# Altium schematic sheet MB1019.SchDoc
size A3; Revision: C.2
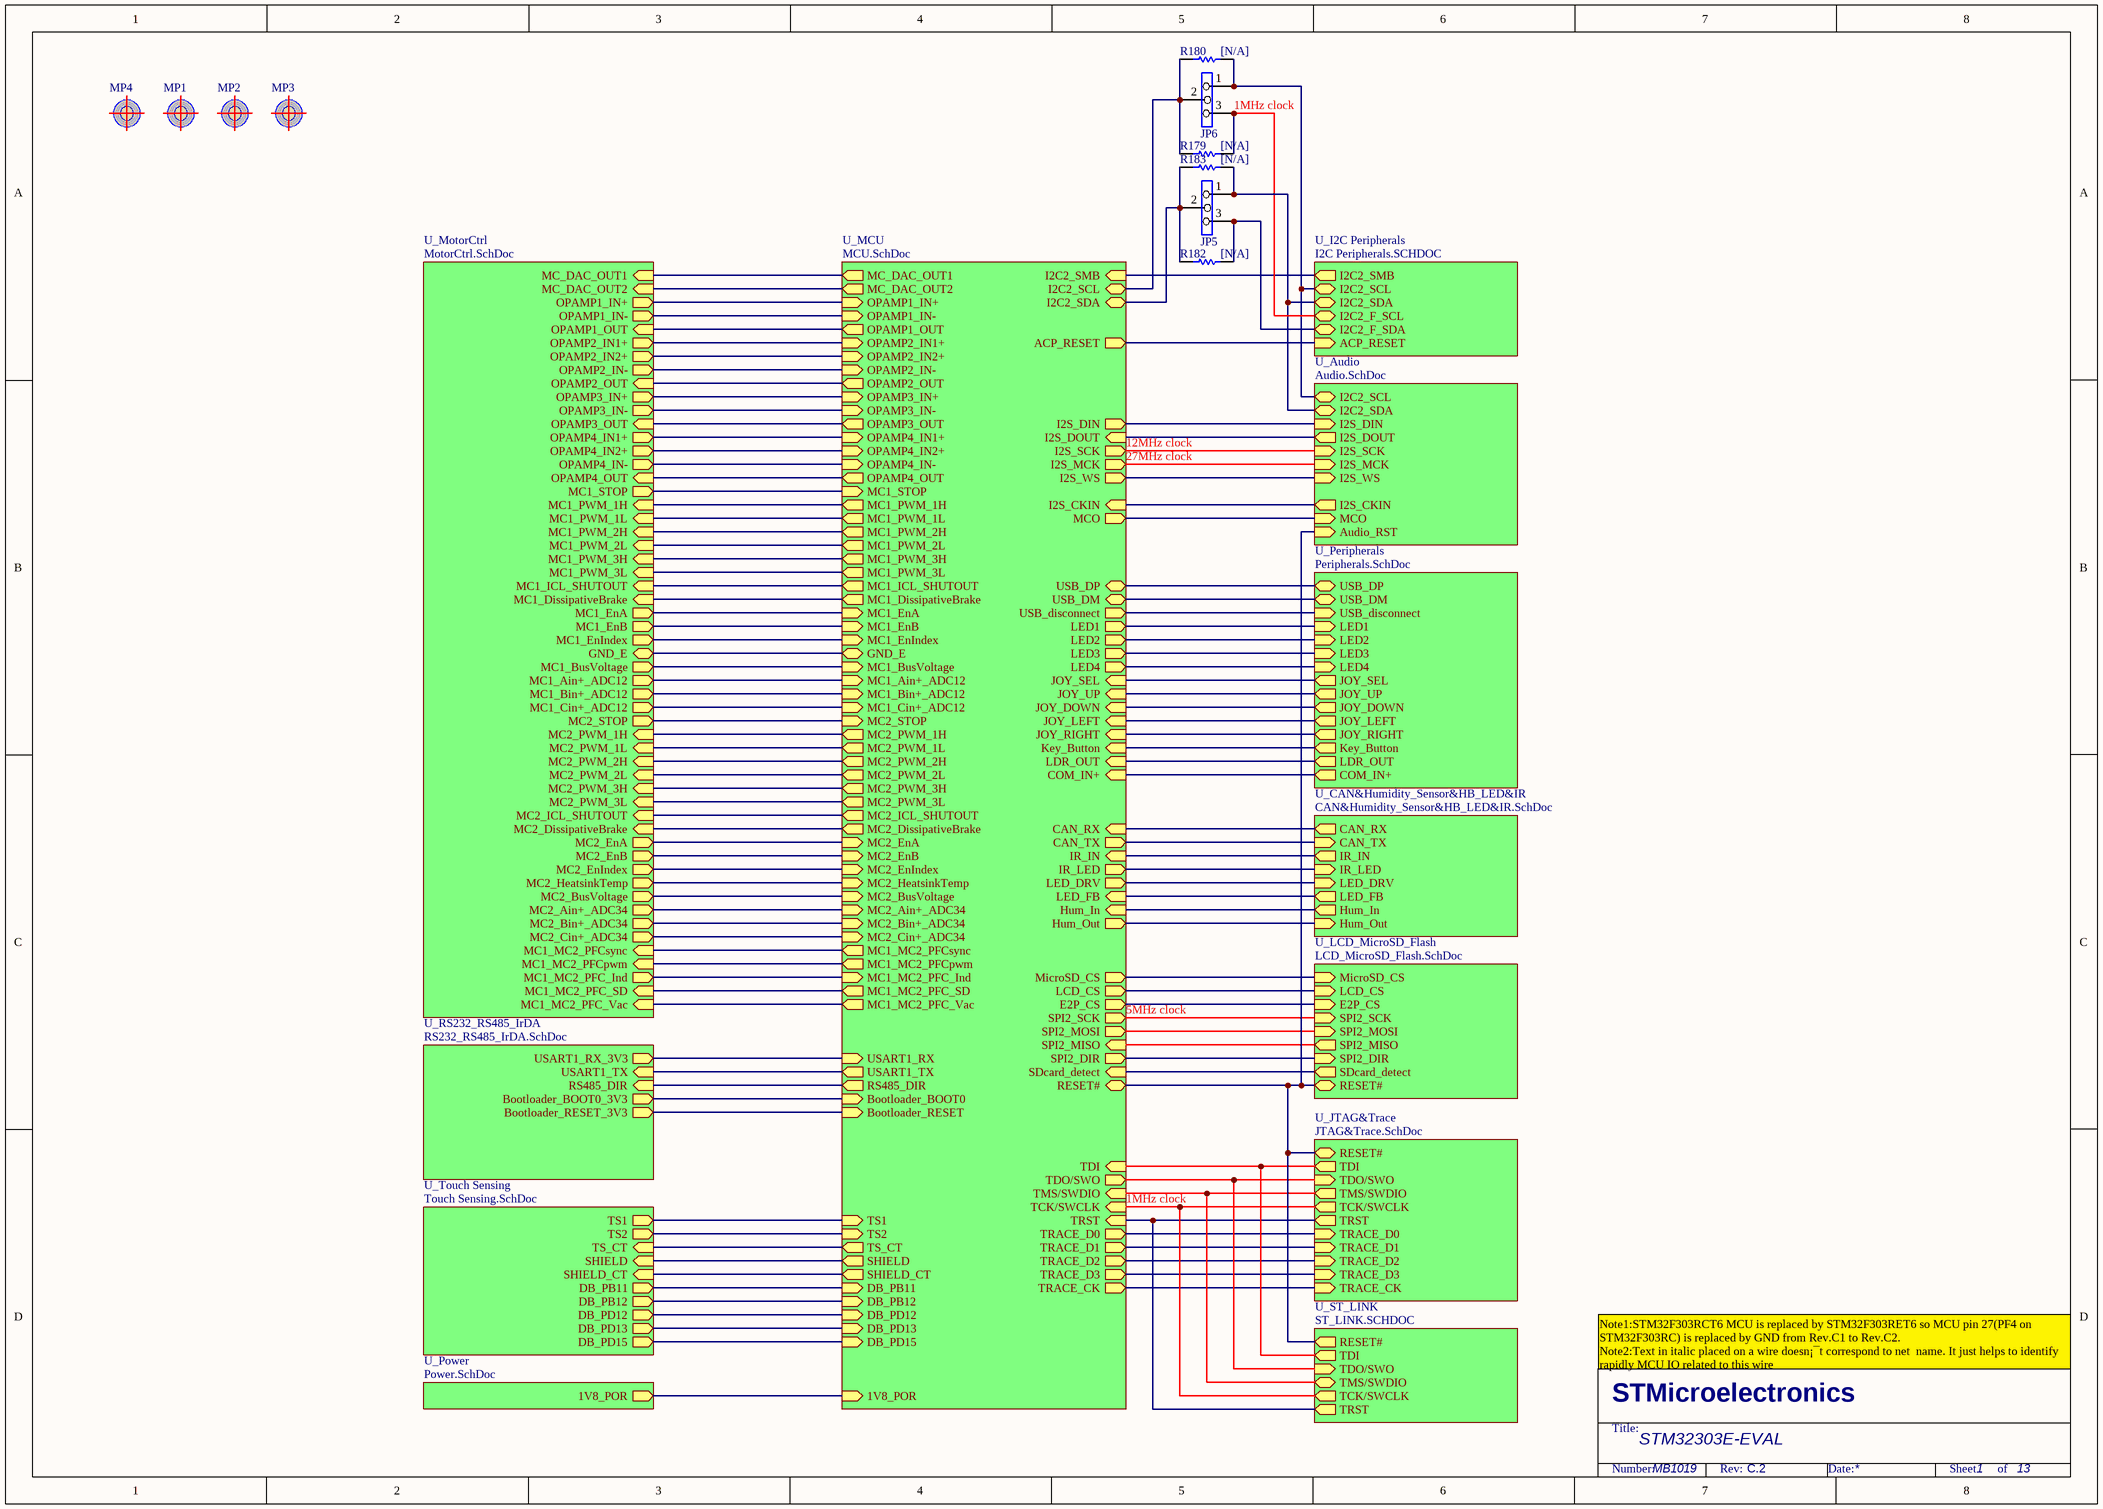
[diagram p0: MB1019.SchDoc]

## Parts
JP5  (no value)  [SIP3]
JP6  (no value)  [SIP3]
MP1  (no value)  [markpoint_1.0]
MP2  (no value)  [markpoint_1.0]
MP3  (no value)  [markpoint_1.0]
MP4  (no value)  [markpoint_1.0]
R179  [N/A]  [0603R]
R180  [N/A]  [0603R]
R182  [N/A]  [0603R]
R183  [N/A]  [0603R]

## Sub-sheets
U_Audio = Audio.SchDoc: I2S_WS (in), I2S_DIN (in), I2S_SCK (in), Audio_RST (in), I2S_MCK (in), MCO (in), I2S_CKIN (out), I2C2_SCL (bidir), I2C2_SDA (bidir), I2S_DOUT (out)
U_CAN&Humidity_Sensor&HB_LED&IR = CAN&Humidity_Sensor&HB_LED&IR.SchDoc: CAN_TX (in), CAN_RX (out), IR_LED (in), IR_IN (out), LED_DRV (in), LED_FB (out), Hum_Out (in), Hum_In (out)
U_I2C Peripherals = I2C Peripherals.SCHDOC: I2C2_SCL (bidir), I2C2_SDA (bidir), I2C2_SMB (out), I2C2_F_SDA (bidir), I2C2_F_SCL (bidir), ACP_RESET (in)
U_JTAG&Trace = JTAG&Trace.SchDoc: TDI (out), RESET# (bidir), TRACE_D3 (in), TRACE_D2 (in), TRACE_D1 (in), TRACE_D0 (in), TRACE_CK (in), TRST (out), TMS/SWDIO (out), TCK/SWCLK (out), TDO/SWO (in)
U_LCD_MicroSD_Flash = LCD_MicroSD_Flash.SchDoc: MicroSD_CS (in), SPI2_SCK (in), SPI2_MOSI (in), LCD_CS (in), SDcard_detect (out), RESET# (bidir), E2P_CS (in), SPI2_MISO (out), SPI2_DIR (in)
U_MCU = MCU.SchDoc: USB_DM (bidir), I2C2_SCL (bidir), I2C2_SDA (bidir), TMS/SWDIO (in), TCK/SWCLK (in), TDI (in), COM_IN+ (in), TDO/SWO (out), TRST (in), IR_IN (in), IR_LED (out), SPI2_MISO (in), SPI2_MOSI (out), RESET# (bidir), LDR_OUT (in), SPI2_SCK (out), USART1_RX (in), USART1_TX (out), LED4 (out), LED3 (out), LED1 (out), LED2 (out), Bootloader_BOOT0 (in), Bootloader_RESET (in), I2C2_SMB (in), USB_DP (bidir), CAN_RX (in), CAN_TX (out), MicroSD_CS (out), TRACE_D0 (out), TRACE_D1 (out), Key_Button (in), JOY_SEL (in), JOY_DOWN (in), JOY_LEFT (in), JOY_UP (in), JOY_RIGHT (in), TRACE_CK (out), E2P_CS (out), LCD_CS (out), TRACE_D2 (out), TRACE_D3 (out), SDcard_detect (in), DB_PD13 (in), DB_PD15 (in), 1V8_POR (in), USB_disconnect (out), MC2_HeatsinkTemp (in), OPAMP1_IN+ (in), OPAMP2_IN1+ (in), OPAMP3_IN+ (in), OPAMP3_OUT (out), OPAMP3_IN- (in), MC2_EnA (in), MC2_STOP (in), MC2_EnIndex (in), OPAMP4_IN- (in), OPAMP4_OUT (out), OPAMP4_IN1+ (in), MC1_Cin+_ADC12 (in), MC1_Ain+_ADC12 (in), MC1_Bin+_ADC12 (in), MC2_PWM_1H (out), MC2_PWM_2H (out), MC2_PWM_3H (out), MC2_PWM_1L (out), MC2_PWM_2L (out), MC2_PWM_3L (out), MC1_MC2_PFC_SD (out), MC1_EnA (in), MC1_EnB (in), MC1_EnIndex (in), MC1_MC2_PFC_Ind (in), MC2_EnB (in), MC1_MC2_PFCsync (out), MC1_MC2_PFCpwm (out), MC1_ICL_SHUTOUT (out), MC1_DissipativeBrake (out), MC1_PWM_1H (out), MC1_PWM_2H (out), MC1_PWM_3H (out), MC1_PWM_1L (out), MC1_PWM_2L (out), MC1_PWM_3L (out), LED_DRV (out), MC1_STOP (in), LED_FB (in), GND_E (bidir), MC2_ICL_SHUTOUT (out), MC2_DissipativeBrake (out), MC1_MC2_PFC_Vac (out), MC2_BusVoltage (in), MC_DAC_OUT1 (out), MC_DAC_OUT2 (out), OPAMP1_OUT (out), OPAMP1_IN- (in), OPAMP2_OUT (out), OPAMP4_IN2+ (in), OPAMP2_IN2+ (in), MC1_BusVoltage (in), RS485_DIR (out), Hum_Out (out), TS2 (in), Hum_In (in), I2S_WS (out), SHIELD (out), OPAMP2_IN- (in), MC2_Cin+_ADC34 (in), MC2_Ain+_ADC34 (in), MC2_Bin+_ADC34 (in), TS_CT (out), TS1 (in), DB_PB12 (in), SHIELD_CT (out), DB_PD12 (in), DB_PB11 (in), ACP_RESET (out), I2S_CKIN (in), MCO (out), I2S_DIN (out), I2S_SCK (out), I2S_MCK (out), I2S_DOUT (in), SPI2_DIR (out)
U_MotorCtrl = MotorCtrl.SchDoc: MC1_STOP (out), MC1_MC2_PFCsync (in), MC1_ICL_SHUTOUT (in), MC1_DissipativeBrake (in), MC1_MC2_PFCpwm (in), MC1_EnA (out), MC1_EnB (out), GND_E (bidir), MC1_BusVoltage (out), MC1_EnIndex (out), MC1_PWM_1H (in), MC1_PWM_2H (in), MC1_PWM_3H (in), MC1_PWM_1L (in), MC1_PWM_2L (in), MC1_PWM_3L (in), MC1_MC2_PFC_Ind (out), MC1_MC2_PFC_Vac (in), MC1_MC2_PFC_SD (in), MC2_STOP (out), MC2_ICL_SHUTOUT (in), MC2_DissipativeBrake (in), MC2_EnA (out), MC2_EnB (out), MC2_HeatsinkTemp (out), MC2_BusVoltage (out), MC2_EnIndex (out), MC2_PWM_1H (in), MC2_PWM_2H (in), MC2_PWM_3H (in), MC2_PWM_1L (in), MC2_PWM_2L (in), MC2_PWM_3L (in), OPAMP1_IN+ (out), OPAMP1_IN- (out), OPAMP1_OUT (in), MC1_Ain+_ADC12 (out), MC_DAC_OUT2 (in), MC_DAC_OUT1 (in), OPAMP2_IN1+ (out), OPAMP2_IN- (out), OPAMP2_OUT (in), OPAMP2_IN2+ (out), OPAMP4_IN1+ (out), OPAMP4_IN- (out), OPAMP4_OUT (in), OPAMP4_IN2+ (out), OPAMP3_IN+ (out), OPAMP3_IN- (out), OPAMP3_OUT (in), MC1_Bin+_ADC12 (out), MC1_Cin+_ADC12 (out), MC2_Cin+_ADC34 (out), MC2_Bin+_ADC34 (out), MC2_Ain+_ADC34 (out)
U_Peripherals = Peripherals.SchDoc: JOY_SEL (out), JOY_DOWN (out), JOY_LEFT (out), JOY_RIGHT (out), JOY_UP (out), USB_DM (bidir), USB_DP (bidir), Key_Button (out), USB_disconnect (in), LDR_OUT (out), COM_IN+ (out), LED4 (in), LED3 (in), LED1 (in), LED2 (in)
U_Power = Power.SchDoc: 1V8_POR (out)
U_RS232_RS485_IrDA = RS232_RS485_IrDA.SchDoc: USART1_RX_3V3 (out), RS485_DIR (in), Bootloader_BOOT0_3V3 (out), Bootloader_RESET_3V3 (out), USART1_TX (in)
U_ST_LINK = ST_LINK.SCHDOC: TDI (out), TRST (out), TMS/SWDIO (bidir), TCK/SWCLK (out), TDO/SWO (in), RESET# (out)
U_Touch Sensing = Touch Sensing.SchDoc: TS1 (out), TS2 (out), SHIELD (in), SHIELD_CT (in), TS_CT (in), DB_PD13 (out), DB_PD15 (out), DB_PD12 (out), DB_PB11 (out), DB_PB12 (out)

## Nets
NetJP5_1: JP5.1 R183.1 ; sheet U_Audio/I2C2_SDA, sheet U_I2C Peripherals/I2C2_SDA
NetJP5_2: JP5.2 R182.2 R183.2 ; sheet U_MCU/I2C2_SDA
NetJP5_3: JP5.3 R182.1 ; sheet U_I2C Peripherals/I2C2_F_SDA
NetJP6_1: JP6.1 R180.1 ; sheet U_Audio/I2C2_SCL, sheet U_I2C Peripherals/I2C2_SCL
NetJP6_2: JP6.2 R179.2 R180.2 ; sheet U_MCU/I2C2_SCL
NetJP6_3: JP6.3 R179.1 ; sheet U_I2C Peripherals/I2C2_F_SCL
(unnamed): sheet U_MCU/USB_DM, sheet U_Peripherals/USB_DM
(unnamed): sheet U_MCU/TMS/SWDIO, sheet U_JTAG&Trace/TMS/SWDIO, sheet U_ST_LINK/TMS/SWDIO
(unnamed): sheet U_MCU/TCK/SWCLK, sheet U_JTAG&Trace/TCK/SWCLK, sheet U_ST_LINK/TCK/SWCLK
(unnamed): sheet U_MCU/TDI, sheet U_JTAG&Trace/TDI, sheet U_ST_LINK/TDI
(unnamed): sheet U_MCU/COM_IN+, sheet U_Peripherals/COM_IN+
(unnamed): sheet U_MCU/TDO/SWO, sheet U_JTAG&Trace/TDO/SWO, sheet U_ST_LINK/TDO/SWO
(unnamed): sheet U_MCU/TRST, sheet U_JTAG&Trace/TRST, sheet U_ST_LINK/TRST
(unnamed): sheet U_MCU/IR_IN, sheet U_CAN&Humidity_Sensor&HB_LED&IR/IR_IN
(unnamed): sheet U_MCU/IR_LED, sheet U_CAN&Humidity_Sensor&HB_LED&IR/IR_LED
(unnamed): sheet U_MCU/SPI2_MISO, sheet U_LCD_MicroSD_Flash/SPI2_MISO
(unnamed): sheet U_MCU/SPI2_MOSI, sheet U_LCD_MicroSD_Flash/SPI2_MOSI
(unnamed): sheet U_MCU/RESET#, sheet U_JTAG&Trace/RESET#, sheet U_ST_LINK/RESET#, sheet U_Audio/Audio_RST, sheet U_LCD_MicroSD_Flash/RESET#
(unnamed): sheet U_MCU/LDR_OUT, sheet U_Peripherals/LDR_OUT
(unnamed): sheet U_MCU/SPI2_SCK, sheet U_LCD_MicroSD_Flash/SPI2_SCK
(unnamed): sheet U_MCU/USART1_RX, sheet U_RS232_RS485_IrDA/USART1_RX_3V3
(unnamed): sheet U_MCU/USART1_TX, sheet U_RS232_RS485_IrDA/USART1_TX
(unnamed): sheet U_MCU/LED4, sheet U_Peripherals/LED4
(unnamed): sheet U_MCU/LED3, sheet U_Peripherals/LED3
(unnamed): sheet U_MCU/LED1, sheet U_Peripherals/LED1
(unnamed): sheet U_MCU/LED2, sheet U_Peripherals/LED2
(unnamed): sheet U_MCU/Bootloader_BOOT0, sheet U_RS232_RS485_IrDA/Bootloader_BOOT0_3V3
(unnamed): sheet U_MCU/Bootloader_RESET, sheet U_RS232_RS485_IrDA/Bootloader_RESET_3V3
(unnamed): sheet U_MCU/I2C2_SMB, sheet U_I2C Peripherals/I2C2_SMB
(unnamed): sheet U_MCU/USB_DP, sheet U_Peripherals/USB_DP
(unnamed): sheet U_MCU/CAN_RX, sheet U_CAN&Humidity_Sensor&HB_LED&IR/CAN_RX
(unnamed): sheet U_MCU/CAN_TX, sheet U_CAN&Humidity_Sensor&HB_LED&IR/CAN_TX
(unnamed): sheet U_MCU/MicroSD_CS, sheet U_LCD_MicroSD_Flash/MicroSD_CS
(unnamed): sheet U_MCU/TRACE_D0, sheet U_JTAG&Trace/TRACE_D0
(unnamed): sheet U_MCU/TRACE_D1, sheet U_JTAG&Trace/TRACE_D1
(unnamed): sheet U_MCU/Key_Button, sheet U_Peripherals/Key_Button
(unnamed): sheet U_MCU/JOY_SEL, sheet U_Peripherals/JOY_SEL
(unnamed): sheet U_MCU/JOY_DOWN, sheet U_Peripherals/JOY_DOWN
(unnamed): sheet U_MCU/JOY_LEFT, sheet U_Peripherals/JOY_LEFT
(unnamed): sheet U_MCU/JOY_UP, sheet U_Peripherals/JOY_UP
(unnamed): sheet U_MCU/JOY_RIGHT, sheet U_Peripherals/JOY_RIGHT
(unnamed): sheet U_MCU/TRACE_CK, sheet U_JTAG&Trace/TRACE_CK
(unnamed): sheet U_MCU/E2P_CS, sheet U_LCD_MicroSD_Flash/E2P_CS
(unnamed): sheet U_MCU/LCD_CS, sheet U_LCD_MicroSD_Flash/LCD_CS
(unnamed): sheet U_MCU/TRACE_D2, sheet U_JTAG&Trace/TRACE_D2
(unnamed): sheet U_MCU/TRACE_D3, sheet U_JTAG&Trace/TRACE_D3
(unnamed): sheet U_MCU/SDcard_detect, sheet U_LCD_MicroSD_Flash/SDcard_detect
(unnamed): sheet U_MCU/DB_PD13, sheet U_Touch Sensing/DB_PD13
(unnamed): sheet U_MCU/DB_PD15, sheet U_Touch Sensing/DB_PD15
(unnamed): sheet U_MCU/1V8_POR, sheet U_Power/1V8_POR
(unnamed): sheet U_MCU/USB_disconnect, sheet U_Peripherals/USB_disconnect
(unnamed): sheet U_MCU/MC2_HeatsinkTemp, sheet U_MotorCtrl/MC2_HeatsinkTemp
(unnamed): sheet U_MCU/OPAMP1_IN+, sheet U_MotorCtrl/OPAMP1_IN+
(unnamed): sheet U_MCU/OPAMP2_IN1+, sheet U_MotorCtrl/OPAMP2_IN1+
(unnamed): sheet U_MCU/OPAMP3_IN+, sheet U_MotorCtrl/OPAMP3_IN+
(unnamed): sheet U_MCU/OPAMP3_OUT, sheet U_MotorCtrl/OPAMP3_OUT
(unnamed): sheet U_MCU/OPAMP3_IN-, sheet U_MotorCtrl/OPAMP3_IN-
(unnamed): sheet U_MCU/MC2_EnA, sheet U_MotorCtrl/MC2_EnA
(unnamed): sheet U_MCU/MC2_STOP, sheet U_MotorCtrl/MC2_STOP
(unnamed): sheet U_MCU/MC2_EnIndex, sheet U_MotorCtrl/MC2_EnIndex
(unnamed): sheet U_MCU/OPAMP4_IN-, sheet U_MotorCtrl/OPAMP4_IN-
(unnamed): sheet U_MCU/OPAMP4_OUT, sheet U_MotorCtrl/OPAMP4_OUT
(unnamed): sheet U_MCU/OPAMP4_IN1+, sheet U_MotorCtrl/OPAMP4_IN1+
(unnamed): sheet U_MCU/MC1_Cin+_ADC12, sheet U_MotorCtrl/MC1_Cin+_ADC12
(unnamed): sheet U_MCU/MC1_Ain+_ADC12, sheet U_MotorCtrl/MC1_Ain+_ADC12
(unnamed): sheet U_MCU/MC1_Bin+_ADC12, sheet U_MotorCtrl/MC1_Bin+_ADC12
(unnamed): sheet U_MCU/MC2_PWM_1H, sheet U_MotorCtrl/MC2_PWM_1H
(unnamed): sheet U_MCU/MC2_PWM_2H, sheet U_MotorCtrl/MC2_PWM_2H
(unnamed): sheet U_MCU/MC2_PWM_3H, sheet U_MotorCtrl/MC2_PWM_3H
(unnamed): sheet U_MCU/MC2_PWM_1L, sheet U_MotorCtrl/MC2_PWM_1L
(unnamed): sheet U_MCU/MC2_PWM_2L, sheet U_MotorCtrl/MC2_PWM_2L
(unnamed): sheet U_MCU/MC2_PWM_3L, sheet U_MotorCtrl/MC2_PWM_3L
(unnamed): sheet U_MCU/MC1_MC2_PFC_SD, sheet U_MotorCtrl/MC1_MC2_PFC_SD
(unnamed): sheet U_MCU/MC1_EnA, sheet U_MotorCtrl/MC1_EnA
(unnamed): sheet U_MCU/MC1_EnB, sheet U_MotorCtrl/MC1_EnB
(unnamed): sheet U_MCU/MC1_EnIndex, sheet U_MotorCtrl/MC1_EnIndex
(unnamed): sheet U_MCU/MC1_MC2_PFC_Ind, sheet U_MotorCtrl/MC1_MC2_PFC_Ind
(unnamed): sheet U_MCU/MC2_EnB, sheet U_MotorCtrl/MC2_EnB
(unnamed): sheet U_MCU/MC1_MC2_PFCsync, sheet U_MotorCtrl/MC1_MC2_PFCsync
(unnamed): sheet U_MCU/MC1_MC2_PFCpwm, sheet U_MotorCtrl/MC1_MC2_PFCpwm
(unnamed): sheet U_MCU/MC1_ICL_SHUTOUT, sheet U_MotorCtrl/MC1_ICL_SHUTOUT
(unnamed): sheet U_MCU/MC1_DissipativeBrake, sheet U_MotorCtrl/MC1_DissipativeBrake
(unnamed): sheet U_MCU/MC1_PWM_1H, sheet U_MotorCtrl/MC1_PWM_1H
(unnamed): sheet U_MCU/MC1_PWM_2H, sheet U_MotorCtrl/MC1_PWM_2H
(unnamed): sheet U_MCU/MC1_PWM_3H, sheet U_MotorCtrl/MC1_PWM_3H
(unnamed): sheet U_MCU/MC1_PWM_1L, sheet U_MotorCtrl/MC1_PWM_1L
(unnamed): sheet U_MCU/MC1_PWM_2L, sheet U_MotorCtrl/MC1_PWM_2L
(unnamed): sheet U_MCU/MC1_PWM_3L, sheet U_MotorCtrl/MC1_PWM_3L
(unnamed): sheet U_MCU/LED_DRV, sheet U_CAN&Humidity_Sensor&HB_LED&IR/LED_DRV
(unnamed): sheet U_MCU/MC1_STOP, sheet U_MotorCtrl/MC1_STOP
(unnamed): sheet U_MCU/LED_FB, sheet U_CAN&Humidity_Sensor&HB_LED&IR/LED_FB
(unnamed): sheet U_MCU/GND_E, sheet U_MotorCtrl/GND_E
(unnamed): sheet U_MCU/MC2_ICL_SHUTOUT, sheet U_MotorCtrl/MC2_ICL_SHUTOUT
(unnamed): sheet U_MCU/MC2_DissipativeBrake, sheet U_MotorCtrl/MC2_DissipativeBrake
(unnamed): sheet U_MCU/MC1_MC2_PFC_Vac, sheet U_MotorCtrl/MC1_MC2_PFC_Vac
(unnamed): sheet U_MCU/MC2_BusVoltage, sheet U_MotorCtrl/MC2_BusVoltage
(unnamed): sheet U_MCU/MC_DAC_OUT1, sheet U_MotorCtrl/MC_DAC_OUT1
(unnamed): sheet U_MCU/MC_DAC_OUT2, sheet U_MotorCtrl/MC_DAC_OUT2
(unnamed): sheet U_MCU/OPAMP1_OUT, sheet U_MotorCtrl/OPAMP1_OUT
(unnamed): sheet U_MCU/OPAMP1_IN-, sheet U_MotorCtrl/OPAMP1_IN-
(unnamed): sheet U_MCU/OPAMP2_OUT, sheet U_MotorCtrl/OPAMP2_OUT
(unnamed): sheet U_MCU/OPAMP4_IN2+, sheet U_MotorCtrl/OPAMP4_IN2+
(unnamed): sheet U_MCU/OPAMP2_IN2+, sheet U_MotorCtrl/OPAMP2_IN2+
(unnamed): sheet U_MCU/MC1_BusVoltage, sheet U_MotorCtrl/MC1_BusVoltage
(unnamed): sheet U_MCU/RS485_DIR, sheet U_RS232_RS485_IrDA/RS485_DIR
(unnamed): sheet U_MCU/Hum_Out, sheet U_CAN&Humidity_Sensor&HB_LED&IR/Hum_Out
(unnamed): sheet U_MCU/TS2, sheet U_Touch Sensing/TS2
(unnamed): sheet U_MCU/Hum_In, sheet U_CAN&Humidity_Sensor&HB_LED&IR/Hum_In
(unnamed): sheet U_MCU/I2S_WS, sheet U_Audio/I2S_WS
(unnamed): sheet U_MCU/SHIELD, sheet U_Touch Sensing/SHIELD
(unnamed): sheet U_MCU/OPAMP2_IN-, sheet U_MotorCtrl/OPAMP2_IN-
(unnamed): sheet U_MCU/MC2_Cin+_ADC34, sheet U_MotorCtrl/MC2_Cin+_ADC34
(unnamed): sheet U_MCU/MC2_Ain+_ADC34, sheet U_MotorCtrl/MC2_Ain+_ADC34
(unnamed): sheet U_MCU/MC2_Bin+_ADC34, sheet U_MotorCtrl/MC2_Bin+_ADC34
(unnamed): sheet U_MCU/TS_CT, sheet U_Touch Sensing/TS_CT
(unnamed): sheet U_MCU/TS1, sheet U_Touch Sensing/TS1
(unnamed): sheet U_MCU/DB_PB12, sheet U_Touch Sensing/DB_PB12
(unnamed): sheet U_MCU/SHIELD_CT, sheet U_Touch Sensing/SHIELD_CT
(unnamed): sheet U_MCU/DB_PD12, sheet U_Touch Sensing/DB_PD12
(unnamed): sheet U_MCU/DB_PB11, sheet U_Touch Sensing/DB_PB11
(unnamed): sheet U_MCU/ACP_RESET, sheet U_I2C Peripherals/ACP_RESET
(unnamed): sheet U_MCU/I2S_CKIN, sheet U_Audio/I2S_CKIN
(unnamed): sheet U_MCU/MCO, sheet U_Audio/MCO
(unnamed): sheet U_MCU/I2S_DIN, sheet U_Audio/I2S_DIN
(unnamed): sheet U_MCU/I2S_SCK, sheet U_Audio/I2S_SCK
(unnamed): sheet U_MCU/I2S_MCK, sheet U_Audio/I2S_MCK
(unnamed): sheet U_MCU/I2S_DOUT, sheet U_Audio/I2S_DOUT
(unnamed): sheet U_MCU/SPI2_DIR, sheet U_LCD_MicroSD_Flash/SPI2_DIR

## Notes on the sheet
- (near JP6) 1MHz clock
- 12MHz clock
- 27MHz clock
- 5MHz clock
- 1MHz clock
- Note1:STM32F303RCT6 MCU is replaced by STM32F303RET6 so MCU pin 27(PF4 on STM32F303RC) is replaced by GND from Rev.C1 to Rev.C2.
  Note2:Text in italic placed on a wire doesn¡¯t correspond to net  name. It just helps to identify rapidly MCU IO related to this wire
- STM32303E-EVAL
- MB1019
- 1
- 13
- STMicroelectronics
- Title:
- Number:
- Rev:
- Date:
- Sheet       of

## Library data of the parts
JP5 JP6 = Jumper3
MP1-MP4 = MARKPOINT
R179 R180 R182 R183 = Res1: Resistor; Value: 1K; Published: 8-Jun-2000; Revision: July-2002: Re-released for DXP Platform.; Publisher: Altium Limited